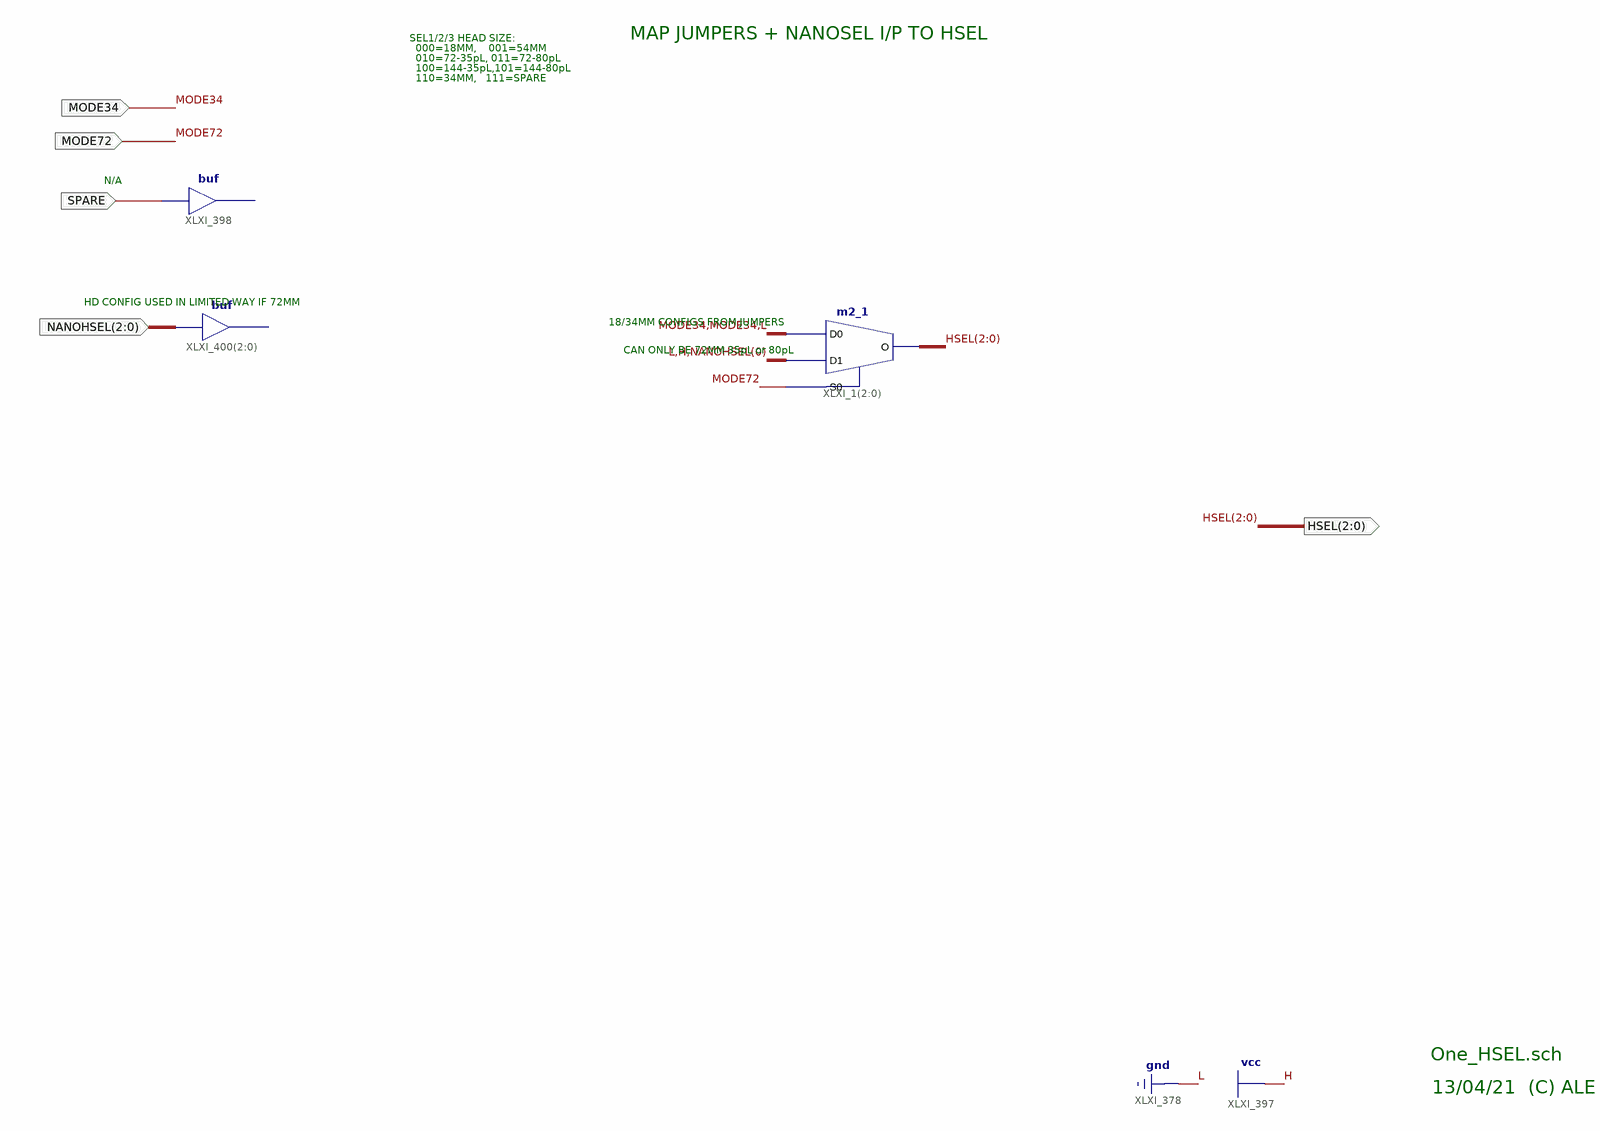
[diagram p0: schematic sheet 1]
// Xilinx ISE schematic One_HSEL.sch (spartan3e) as structural Verilog: 3 symbols, 5 ports
module One_HSEL (
  input  MODE34,
  input  MODE72,
  input  [2:0] NANOHSEL,
  input  SPARE,
  output [2:0] HSEL
);

  m2_1 XLXI_1[2:0] (.D0({{2{MODE34}}, 1'b0}), .D1({2'b01, NANOHSEL[0]}), .S0(MODE72), .O(HSEL));
  // buf XLXI_398 has open pins: I=SPARE, O=open
  // buf XLXI_400[2..0] has open pins: I=NANOHSEL, O=open

  // Notes on the sheet:
  //   MAP JUMPERS + NANOSEL I/P TO HSEL
  //   SEL1/2/3 HEAD SIZE:
  //   000=18MM,    001=54MM
  //   010=72-35pL, 011=72-80pL
  //   100=144-35pL,101=144-80pL
  //   110=34MM,   111=SPARE
  //   N/A
  //   HD CONFIG USED IN LIMITED WAY IF 72MM
  //   18/34MM CONFIGS FROM JUMPERS
  //   CAN ONLY BE 72MM 35pL or 80pL
  //   One_HSEL.sch
  //   13/04/21  (C) ALE
endmodule
